# Altium project FlameClock_1.1.PrjPcb
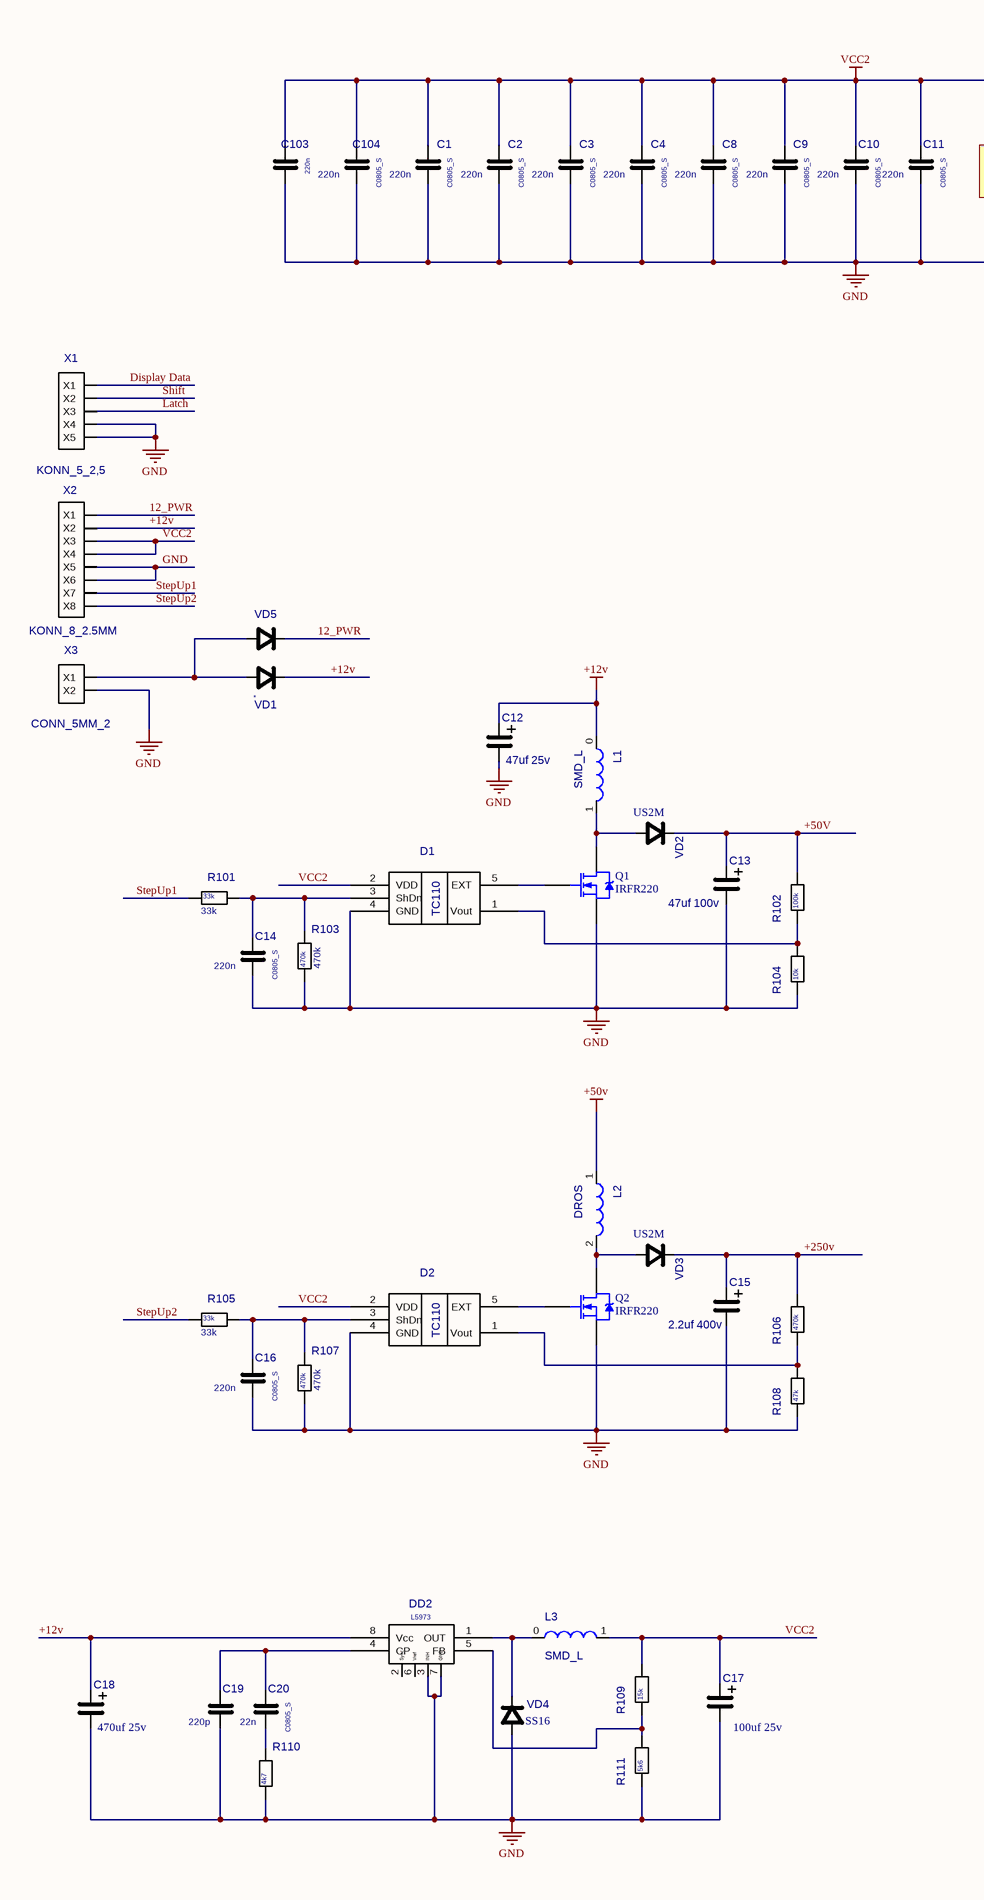
[diagram p0: FlameClock_1.1.SchDoc, left]
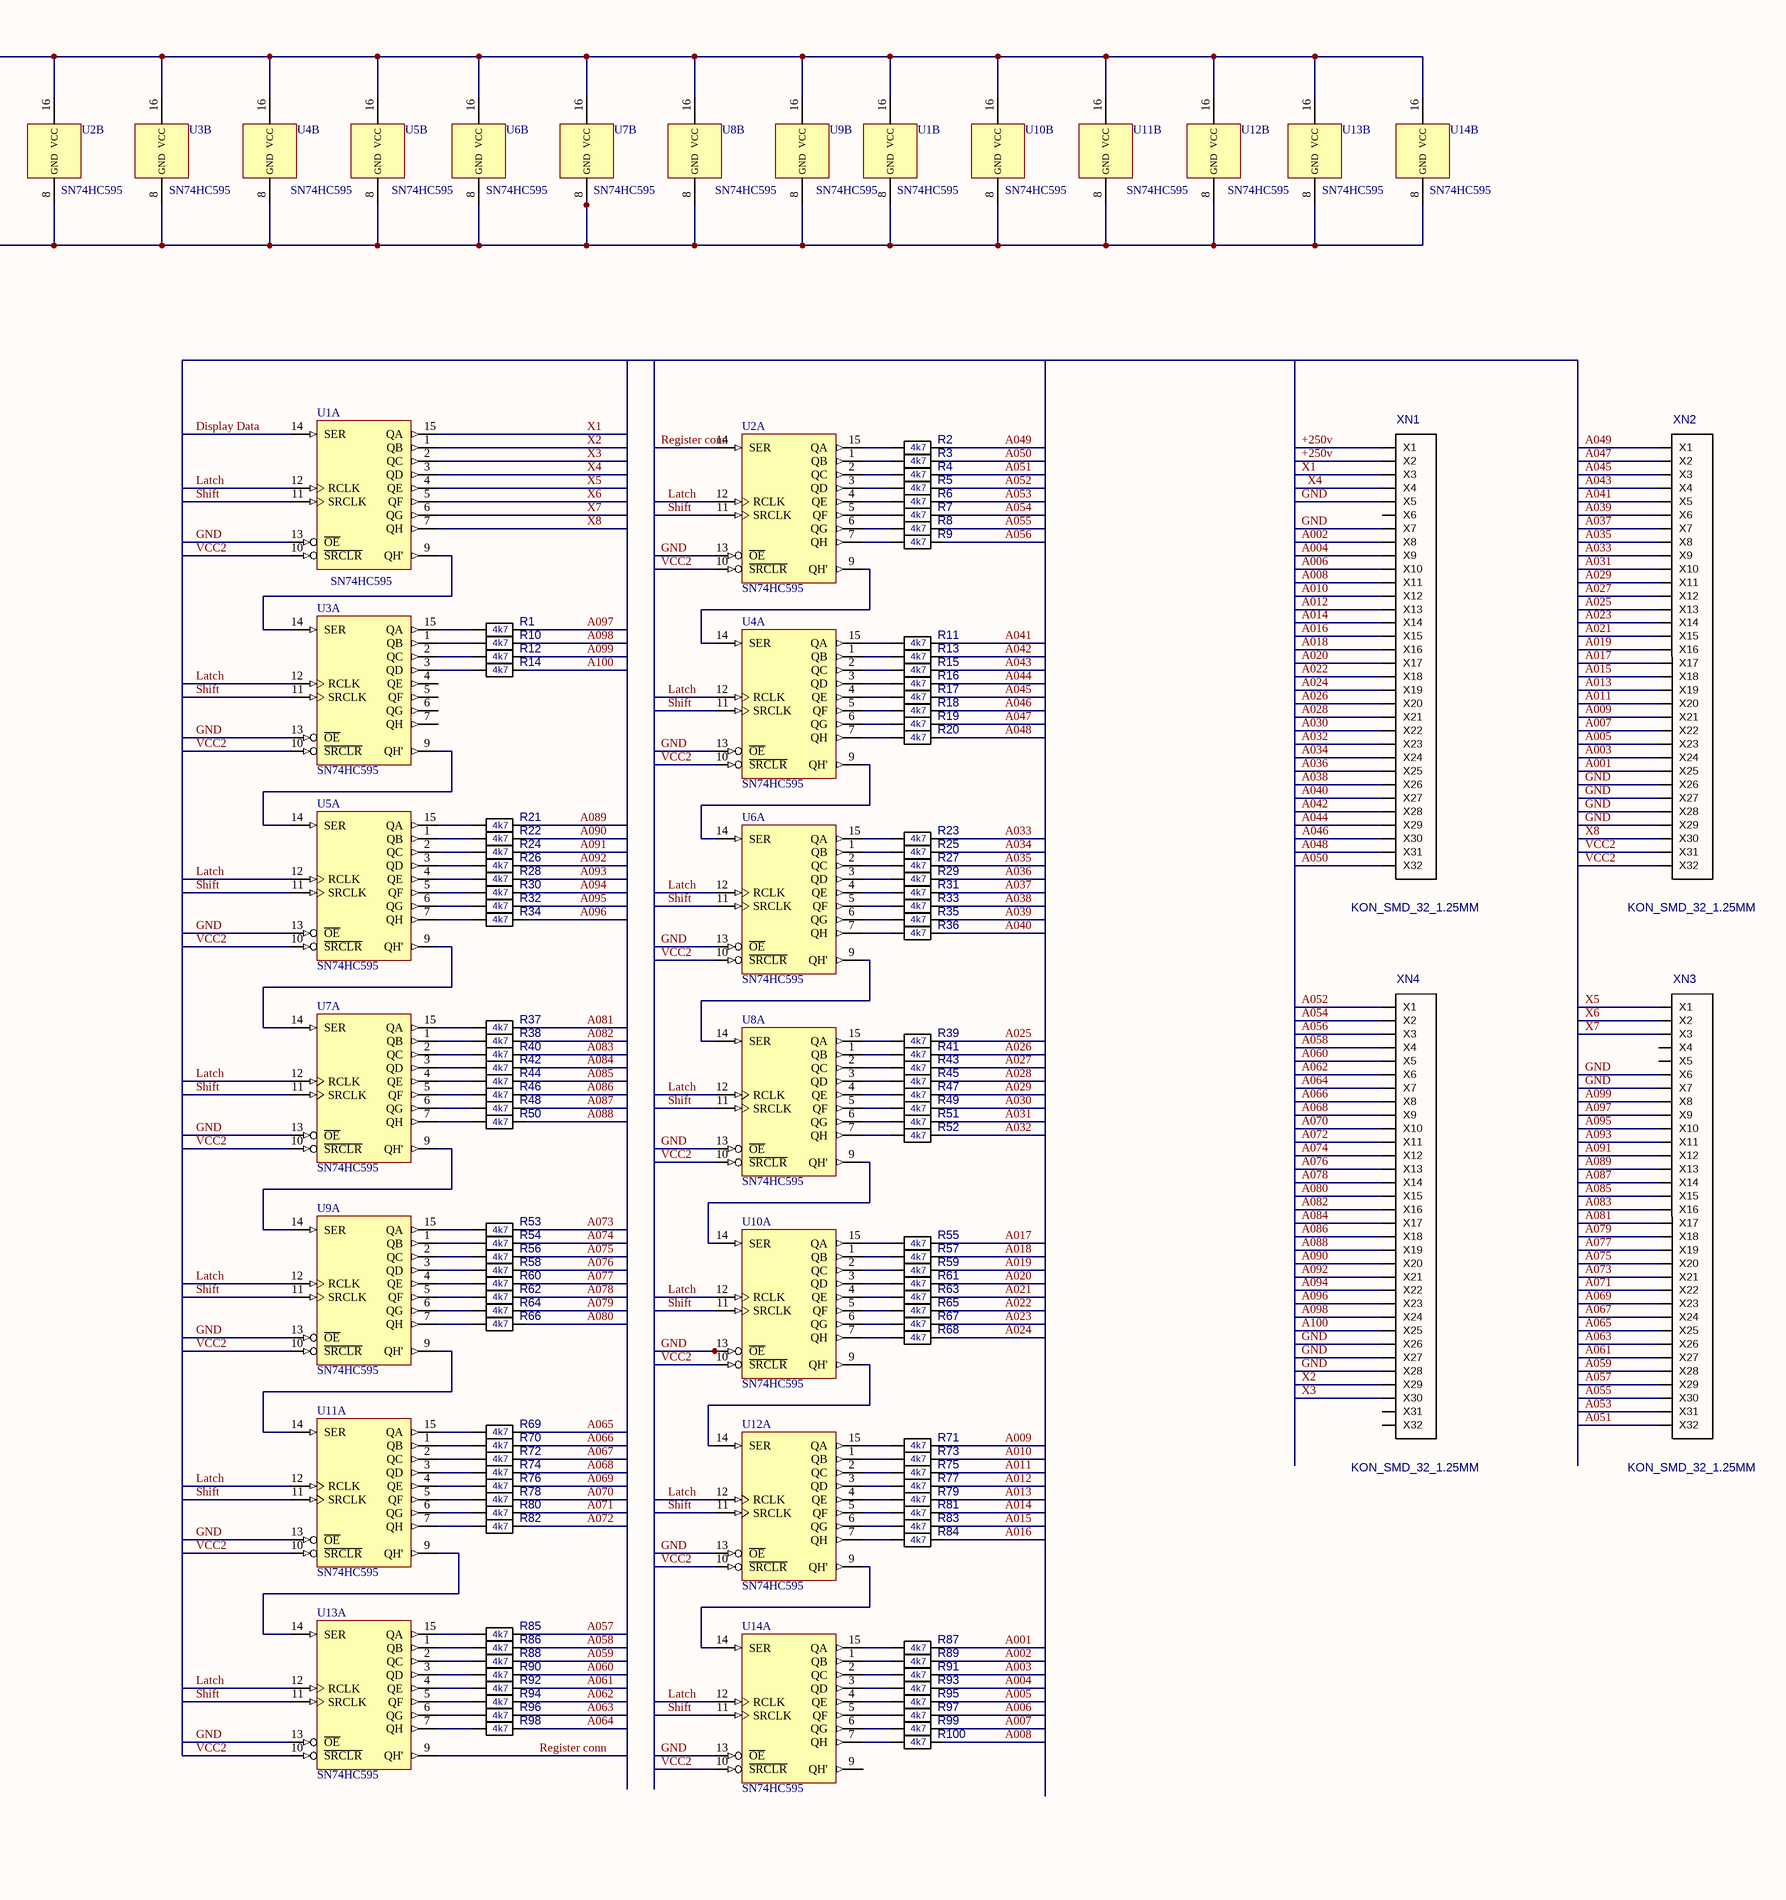
[diagram p1: FlameClock_1.1.SchDoc, right]
2 sheets, 205 parts. Net scope: global (net labels, ports and power ports of the same name join across sheets).
Board files: FlameClock_1.1.PcbDoc, FlameClock_1.1_sh2.PcbDoc
Sheets:
  FlameClock_1.1.SchDoc
  FlameClock_1.1_sh2.SchDoc

## Sheet FlameClock_1.1.SchDoc
size A2

### Parts
C1  C0805_S  value 220n  [CC0805_S]
C2  C0805_S  value 220n  [CC0805_S]
C3  C0805_S  value 220n  [CC0805_S]
C4  C0805_S  value 220n  [CC0805_S]
C8  C0805_S  value 220n  [CC0805_S]
C9  C0805_S  value 220n  [CC0805_S]
C10  C0805_S  value 220n  [CC0805_S]
C11  C0805_S  value 220n  [CC0805_S]
C12  47uf 25v  [CE3.8]
C13  47uf 100v  [CE3.8]
C14  C0805_S  value 220n  [CC0805_S]
C15  2.2uf 400v  [CE3.8]
C16  C0805_S  value 220n  [CC0805_S]
C17  100uf 25v  [CE3.8]
C18  470uf 25v  [CE10]
C19  value 220p  [CC0805_S]  (hidden comment: C0805_S)
C20  C0805_S  value 22n  [CC0805_S]
C103  220n  [CC0805_S]
C104  C0805_S  value 220n  [CC0805_S]
D1  TC110  [SOT-23A]
D2  TC110  [SOT-23A]
DD2  L5973  [SO8 - termal]
L1  SMD_L  [SMD_L]
L2  DROS  [DROS]
L3  SMD_L  [SMD_L]
Q1  IRFR220  [TO-252AA_N]
Q2  IRFR220  [TO-252AA_N]
R1  value 4k7  [R0805_S]  (hidden comment: R0805_S)
R2  value 4k7  [R0805_S]  (hidden comment: R0805_S)
R3  value 4k7  [R0805_S]  (hidden comment: R0805_S)
R4  value 4k7  [R0805_S]  (hidden comment: R0805_S)
R5  value 4k7  [R0805_S]  (hidden comment: R0805_S)
R6  value 4k7  [R0805_S]  (hidden comment: R0805_S)
R7  value 4k7  [R0805_S]  (hidden comment: R0805_S)
R8  value 4k7  [R0805_S]  (hidden comment: R0805_S)
R9  value 4k7  [R0805_S]  (hidden comment: R0805_S)
R10  value 4k7  [R0805_S]  (hidden comment: R0805_S)
R11  value 4k7  [R0805_S]  (hidden comment: R0805_S)
R12  value 4k7  [R0805_S]  (hidden comment: R0805_S)
R13  value 4k7  [R0805_S]  (hidden comment: R0805_S)
R14  value 4k7  [R0805_S]  (hidden comment: R0805_S)
R15  value 4k7  [R0805_S]  (hidden comment: R0805_S)
R16  value 4k7  [R0805_S]  (hidden comment: R0805_S)
R17  value 4k7  [R0805_S]  (hidden comment: R0805_S)
R18  value 4k7  [R0805_S]  (hidden comment: R0805_S)
R19  value 4k7  [R0805_S]  (hidden comment: R0805_S)
R20  value 4k7  [R0805_S]  (hidden comment: R0805_S)
R21  value 4k7  [R0805_S]  (hidden comment: R0805_S)
R22  value 4k7  [R0805_S]  (hidden comment: R0805_S)
R23  value 4k7  [R0805_S]  (hidden comment: R0805_S)
R24  value 4k7  [R0805_S]  (hidden comment: R0805_S)
R25  value 4k7  [R0805_S]  (hidden comment: R0805_S)
R26  value 4k7  [R0805_S]  (hidden comment: R0805_S)
R27  value 4k7  [R0805_S]  (hidden comment: R0805_S)
R28  value 4k7  [R0805_S]  (hidden comment: R0805_S)
R29  value 4k7  [R0805_S]  (hidden comment: R0805_S)
R30  value 4k7  [R0805_S]  (hidden comment: R0805_S)
R31  value 4k7  [R0805_S]  (hidden comment: R0805_S)
R32  value 4k7  [R0805_S]  (hidden comment: R0805_S)
R33  value 4k7  [R0805_S]  (hidden comment: R0805_S)
R34  value 4k7  [R0805_S]  (hidden comment: R0805_S)
R35  value 4k7  [R0805_S]  (hidden comment: R0805_S)
R36  value 4k7  [R0805_S]  (hidden comment: R0805_S)
R37  value 4k7  [R0805_S]  (hidden comment: R0805_S)
R38  value 4k7  [R0805_S]  (hidden comment: R0805_S)
R39  value 4k7  [R0805_S]  (hidden comment: R0805_S)
R40  value 4k7  [R0805_S]  (hidden comment: R0805_S)
R41  value 4k7  [R0805_S]  (hidden comment: R0805_S)
R42  value 4k7  [R0805_S]  (hidden comment: R0805_S)
R43  value 4k7  [R0805_S]  (hidden comment: R0805_S)
R44  value 4k7  [R0805_S]  (hidden comment: R0805_S)
R45  value 4k7  [R0805_S]  (hidden comment: R0805_S)
R46  value 4k7  [R0805_S]  (hidden comment: R0805_S)
R47  value 4k7  [R0805_S]  (hidden comment: R0805_S)
R48  value 4k7  [R0805_S]  (hidden comment: R0805_S)
R49  value 4k7  [R0805_S]  (hidden comment: R0805_S)
R50  value 4k7  [R0805_S]  (hidden comment: R0805_S)
R51  value 4k7  [R0805_S]  (hidden comment: R0805_S)
R52  value 4k7  [R0805_S]  (hidden comment: R0805_S)
R53  value 4k7  [R0805_S]  (hidden comment: R0805_S)
R54  value 4k7  [R0805_S]  (hidden comment: R0805_S)
R55  value 4k7  [R0805_S]  (hidden comment: R0805_S)
R56  value 4k7  [R0805_S]  (hidden comment: R0805_S)
R57  value 4k7  [R0805_S]  (hidden comment: R0805_S)
R58  value 4k7  [R0805_S]  (hidden comment: R0805_S)
R59  value 4k7  [R0805_S]  (hidden comment: R0805_S)
R60  value 4k7  [R0805_S]  (hidden comment: R0805_S)
R61  value 4k7  [R0805_S]  (hidden comment: R0805_S)
R62  value 4k7  [R0805_S]  (hidden comment: R0805_S)
R63  value 4k7  [R0805_S]  (hidden comment: R0805_S)
R64  value 4k7  [R0805_S]  (hidden comment: R0805_S)
R65  value 4k7  [R0805_S]  (hidden comment: R0805_S)
R66  value 4k7  [R0805_S]  (hidden comment: R0805_S)
R67  value 4k7  [R0805_S]  (hidden comment: R0805_S)
R68  value 4k7  [R0805_S]  (hidden comment: R0805_S)
R69  value 4k7  [R0805_S]  (hidden comment: R0805_S)
R70  value 4k7  [R0805_S]  (hidden comment: R0805_S)
R71  value 4k7  [R0805_S]  (hidden comment: R0805_S)
R72  value 4k7  [R0805_S]  (hidden comment: R0805_S)
R73  value 4k7  [R0805_S]  (hidden comment: R0805_S)
R74  value 4k7  [R0805_S]  (hidden comment: R0805_S)
R75  value 4k7  [R0805_S]  (hidden comment: R0805_S)
R76  value 4k7  [R0805_S]  (hidden comment: R0805_S)
R77  value 4k7  [R0805_S]  (hidden comment: R0805_S)
R78  value 4k7  [R0805_S]  (hidden comment: R0805_S)
R79  value 4k7  [R0805_S]  (hidden comment: R0805_S)
R80  value 4k7  [R0805_S]  (hidden comment: R0805_S)
R81  value 4k7  [R0805_S]  (hidden comment: R0805_S)
R82  value 4k7  [R0805_S]  (hidden comment: R0805_S)
R83  value 4k7  [R0805_S]  (hidden comment: R0805_S)
R84  value 4k7  [R0805_S]  (hidden comment: R0805_S)
R85  value 4k7  [R0805_S]  (hidden comment: R0805_S)
R86  value 4k7  [R0805_S]  (hidden comment: R0805_S)
R87  value 4k7  [R0805_S]  (hidden comment: R0805_S)
R88  value 4k7  [R0805_S]  (hidden comment: R0805_S)
R89  value 4k7  [R0805_S]  (hidden comment: R0805_S)
R90  value 4k7  [R0805_S]  (hidden comment: R0805_S)
R91  value 4k7  [R0805_S]  (hidden comment: R0805_S)
R92  value 4k7  [R0805_S]  (hidden comment: R0805_S)
R93  value 4k7  [R0805_S]  (hidden comment: R0805_S)
R94  value 4k7  [R0805_S]  (hidden comment: R0805_S)
R95  value 4k7  [R0805_S]  (hidden comment: R0805_S)
R96  value 4k7  [R0805_S]  (hidden comment: R0805_S)
R97  value 4k7  [R0805_S]  (hidden comment: R0805_S)
R98  value 4k7  [R0805_S]  (hidden comment: R0805_S)
R99  value 4k7  [R0805_S]  (hidden comment: R0805_S)
R100  value 4k7  [R0805_S]  (hidden comment: R0805_S)
R101  33k  [R0805_S]
R102  100k  [R0805_S]
R103  470k  [R0805_S]
R104  10k  [R0805_S]
R105  33k  [R0805_S]
R106  470k  [R0805_S]
R107  470k  [R0805_S]
R108  47k  [R0805_S]
R109  15k  [R0805_S]
R110  4k7  [R0805_S]
R111  5k6  [R0805_S]
U1  SN74HC595  [SOIC16]  (parts A,B of 2)
U2  SN74HC595  [SOIC16]  (parts A,B of 2)
U3  SN74HC595  [SOIC16]  (parts A,B of 2)
U4  SN74HC595  [SOIC16]  (parts A,B of 2)
U5  SN74HC595  [SOIC16]  (parts A,B of 2)
U6  SN74HC595  [SOIC16]  (parts A,B of 2)
U7  SN74HC595  [SOIC16]  (parts A,B of 2)
U8  SN74HC595  [SOIC16]  (parts A,B of 2)
U9  SN74HC595  [SOIC16]  (parts A,B of 2)
U10  SN74HC595  [SOIC16]  (parts A,B of 2)
U11  SN74HC595  [SOIC16]  (parts A,B of 2)
U12  SN74HC595  [SOIC16]  (parts A,B of 2)
U13  SN74HC595  [SOIC16]  (parts A,B of 2)
U14  SN74HC595  [SOIC16]  (parts A,B of 2)
VD1  *  [DIOD_SS2]
VD2  value US2M  [DIOD_SS1]  (hidden comment: DIODE_SS1)
VD3  value US2M  [DIOD_SS1]  (hidden comment: DIODE_SS1)
VD4  value SS16  [DIOD_SS1]  (hidden comment: DIODE_SS1)
VD5  DIODE_SS1  [DIOD_SS1]  (value not drawn)
X1  KONN_5_2,5  [KONN_5_2.5MM]
X2  KONN_8_2.5MM  [KONN_8_2.5MM]
X3  CONN_5MM_2  [CONN5_2]
XN1  KON_SMD_32_1.25MM  [KON_SMD_32_1.25MM]
XN2  KON_SMD_32_1.25MM  [KON_SMD_32_1.25MM]
XN3  KON_SMD_32_1.25MM  [KON_SMD_32_1.25MM]
XN4  KON_SMD_32_1.25MM  [KON_SMD_32_1.25MM]

### Nets
+12v: C12.1(pl) C18.1(pl) DD2.8(Vcc) L1.0 VD1.1 X2.2(X2)
+50V: C13.1(pl) L2.1 R102.1 VD2.1
GND: C1.2 C2.2 C3.2 C4.2 C8.2 C9.2 C10.2 C11.2 C12.2(min) C13.2(min) C14.2 C15.2(min) C16.2 C17.2(min) C18.2(min) C19.2 C103.2 C104.2 D1.4(GND) D2.4(GND) DD2.3(INH) DD2.7(GND) Q1.3(S) Q2.3(S) R103.2 R104.2 R107.2 R108.2 R110.2 R111.2 U1.8(GND) U1.13(~{OE}) U2.8(GND) U2.13(~{OE}) U3.8(GND) U3.13(~{OE}) U4.8(GND) U4.13(~{OE}) U5.8(GND) U5.13(~{OE}) U6.8(GND) U6.13(~{OE}) U7.8(GND) U7.13(~{OE}) U8.8(GND) U8.13(~{OE}) U9.8(GND) U9.13(~{OE}) U10.8(GND) U10.13(~{OE}) U11.8(GND) U11.13(~{OE}) U12.8(GND) U12.13(~{OE}) U13.8(GND) U13.13(~{OE}) U14.8(GND) U14.13(~{OE}) VD4.2 X1.4(X4) X1.5(X5) X2.5(X5) X2.6(X6) X3.2(X2) XN1.5(X5) XN1.7(X7) XN2.26(X26) XN2.27(X27) XN2.28(X28) XN2.29(X29) XN3.6(X6) XN3.7(X7) XN4.26(X26) XN4.27(X27) XN4.28(X28)
VCC2: C1.1 C2.1 C3.1 C4.1 C8.1 C9.1 C10.1 C11.1 C17.1(pl) C103.1 C104.1 D1.2(VDD) D2.2(VDD) L3.1 R109.1 U1.10(~{SRCLR}) U1.16(VCC) U2.10(~{SRCLR}) U2.16(VCC) U3.10(~{SRCLR}) U3.16(VCC) U4.10(~{SRCLR}) U4.16(VCC) U5.10(~{SRCLR}) U5.16(VCC) U6.10(~{SRCLR}) U6.16(VCC) U7.10(~{SRCLR}) U7.16(VCC) U8.10(~{SRCLR}) U8.16(VCC) U9.10(~{SRCLR}) U9.16(VCC) U10.10(~{SRCLR}) U10.16(VCC) U11.10(~{SRCLR}) U11.16(VCC) U12.10(~{SRCLR}) U12.16(VCC) U13.10(~{SRCLR}) U13.16(VCC) U14.10(~{SRCLR}) U14.16(VCC) X2.3(X3) X2.4(X4) XN2.31(X31) XN2.32(X32)
12_PWR: VD5.1 X2.1(X1)
+250v: C15.1(pl) R106.1 VD3.1 XN1.1(X1) XN1.2(X2)
A001: R87.1 XN2.25(X25)
A002: R89.1 XN1.8(X8)
A003: R91.1 XN2.24(X24)
A004: R93.1 XN1.9(X9)
A005: R95.1 XN2.23(X23)
A006: R97.1 XN1.10(X10)
A007: R99.1 XN2.22(X22)
A008: R100.1 XN1.11(X11)
A009: R71.1 XN2.21(X21)
A010: R73.1 XN1.12(X12)
A011: R75.1 XN2.20(X20)
A012: R77.1 XN1.13(X13)
A013: R79.1 XN2.19(X19)
A014: R81.1 XN1.14(X14)
A015: R83.1 XN2.18(X18)
A016: R84.1 XN1.15(X15)
A017: R55.1 XN2.17(X17)
A018: R57.1 XN1.16(X16)
A019: R59.1 XN2.16(X16)
A020: R61.1 XN1.17(X17)
A021: R63.1 XN2.15(X15)
A022: R65.1 XN1.18(X18)
A023: R67.1 XN2.14(X14)
A024: R68.1 XN1.19(X19)
A025: R39.1 XN2.13(X13)
A026: R41.1 XN1.20(X20)
A027: R43.1 XN2.12(X12)
A028: R45.1 XN1.21(X21)
A029: R47.1 XN2.11(X11)
A030: R49.1 XN1.22(X22)
A031: R51.1 XN2.10(X10)
A032: R52.1 XN1.23(X23)
A033: R23.1 XN2.9(X9)
A034: R25.1 XN1.24(X24)
A035: R27.1 XN2.8(X8)
A036: R29.1 XN1.25(X25)
A037: R31.1 XN2.7(X7)
A038: R33.1 XN1.26(X26)
A039: R35.1 XN2.6(X6)
A040: R36.1 XN1.27(X27)
A041: R11.1 XN2.5(X5)
A042: R13.1 XN1.28(X28)
A043: R15.1 XN2.4(X4)
A044: R16.1 XN1.29(X29)
A045: R17.1 XN2.3(X3)
A046: R18.1 XN1.30(X30)
A047: R19.1 XN2.2(X2)
A048: R20.1 XN1.31(X31)
A049: R2.1 XN2.1(X1)
A050: R3.1 XN1.32(X32)
A051: R4.1 XN3.32(X32)
A052: R5.1 XN4.1(X1)
A053: R6.1 XN3.31(X31)
A054: R7.1 XN4.2(X2)
A055: R8.1 XN3.30(X30)
A056: R9.1 XN4.3(X3)
A057: R85.1 XN3.29(X29)
A058: R86.1 XN4.4(X4)
A059: R88.1 XN3.28(X28)
A060: R90.1 XN4.5(X5)
A061: R92.1 XN3.27(X27)
A062: R94.1 XN4.6(X6)
A063: R96.1 XN3.26(X26)
A064: R98.1 XN4.7(X7)
A065: R69.1 XN3.25(X25)
A066: R70.1 XN4.8(X8)
A067: R72.1 XN3.24(X24)
A068: R74.1 XN4.9(X9)
A069: R76.1 XN3.23(X23)
A070: R78.1 XN4.10(X10)
A071: R80.1 XN3.22(X22)
A072: R82.1 XN4.11(X11)
A073: R53.1 XN3.21(X21)
A074: R54.1 XN4.12(X12)
A075: R56.1 XN3.20(X20)
A076: R58.1 XN4.13(X13)
A077: R60.1 XN3.19(X19)
A078: R62.1 XN4.14(X14)
A079: R64.1 XN3.18(X18)
A080: R66.1 XN4.15(X15)
A081: R37.1 XN3.17(X17)
A082: R38.1 XN4.16(X16)
A083: R40.1 XN3.16(X16)
A084: R42.1 XN4.17(X17)
A085: R44.1 XN3.15(X15)
A086: R46.1 XN4.18(X18)
A087: R48.1 XN3.14(X14)
A088: R50.1 XN4.19(X19)
A089: R21.1 XN3.13(X13)
A090: R22.1 XN4.20(X20)
A091: R24.1 XN3.12(X12)
A092: R26.1 XN4.21(X21)
A093: R28.1 XN3.11(X11)
A094: R30.1 XN4.22(X22)
A095: R32.1 XN3.10(X10)
A096: R34.1 XN4.23(X23)
A097: R1.1 XN3.9(X9)
A098: R10.1 XN4.24(X24)
A099: R12.1 XN3.8(X8)
A100: R14.1 XN4.25(X25)
Display Data: U1.14(SER) X1.1(X1)
Latch: U1.12(RCLK) U2.12(RCLK) U3.12(RCLK) U4.12(RCLK) U5.12(RCLK) U6.12(RCLK) U7.12(RCLK) U8.12(RCLK) U9.12(RCLK) U10.12(RCLK) U11.12(RCLK) U12.12(RCLK) U13.12(RCLK) U14.12(RCLK) X1.3(X3)
Register conn: U2.14(SER) U13.9(QH')
Shift: U1.11(SRCLK) U2.11(SRCLK) U3.11(SRCLK) U4.11(SRCLK) U5.11(SRCLK) U6.11(SRCLK) U7.11(SRCLK) U8.11(SRCLK) U9.11(SRCLK) U10.11(SRCLK) U11.11(SRCLK) U12.11(SRCLK) U13.11(SRCLK) U14.11(SRCLK) X1.2(X2)
StepUp1: R101.2 X2.7(X7)
StepUp2: R105.2 X2.8(X8)
X1: U1.15(QA) XN1.3(X3)
X2: U1.1(QB) XN4.29(X29)
X3: U1.2(QC) XN4.30(X30)
X4: U1.3(QD) XN1.4(X4)
X5: U1.4(QE) XN3.1(X1)
X6: U1.5(QF) XN3.2(X2)
X7: U1.6(QG) XN3.3(X3)
X8: U1.7(QH) XN2.30(X30)
NetC14_1: C14.1 D1.3(ShDn) R101.1 R103.1
NetC16_1: C16.1 D2.3(ShDn) R105.1 R107.1
NetC19_1: C19.1 C20.1 DD2.4(CP)
NetC20_2: C20.2 R110.1
NetD1_1: D1.1(Vout) R102.2 R104.1
NetD1_5: D1.5(EXT) Q1.1(G)
NetD2_1: D2.1(Vout) R106.2 R108.1
NetD2_5: D2.5(EXT) Q2.1(G)
NetDD2_1: DD2.1(OUT) L3.0 VD4.1
NetDD2_5: DD2.5(FB) R109.2 R111.1
NetL1_1: L1.1 Q1.4(D) VD2.2
NetL2_2: L2.2 Q2.4(D) VD3.2
NetR1_2: R1.2 U3.15(QA)
NetR2_2: R2.2 U2.15(QA)
NetR3_2: R3.2 U2.1(QB)
NetR4_2: R4.2 U2.2(QC)
NetR5_2: R5.2 U2.3(QD)
NetR6_2: R6.2 U2.4(QE)
NetR7_2: R7.2 U2.5(QF)
NetR8_2: R8.2 U2.6(QG)
NetR9_2: R9.2 U2.7(QH)
NetR10_2: R10.2 U3.1(QB)
NetR11_2: R11.2 U4.15(QA)
NetR12_2: R12.2 U3.2(QC)
NetR13_2: R13.2 U4.1(QB)
NetR14_2: R14.2 U3.3(QD)
NetR15_2: R15.2 U4.2(QC)
NetR16_2: R16.2 U4.3(QD)
NetR17_2: R17.2 U4.4(QE)
NetR18_2: R18.2 U4.5(QF)
NetR19_2: R19.2 U4.6(QG)
NetR20_2: R20.2 U4.7(QH)
NetR21_2: R21.2 U5.15(QA)
NetR22_2: R22.2 U5.1(QB)
NetR23_2: R23.2 U6.15(QA)
NetR24_2: R24.2 U5.2(QC)
NetR25_2: R25.2 U6.1(QB)
NetR26_2: R26.2 U5.3(QD)
NetR27_2: R27.2 U6.2(QC)
NetR28_2: R28.2 U5.4(QE)
NetR29_2: R29.2 U6.3(QD)
NetR30_2: R30.2 U5.5(QF)
NetR31_2: R31.2 U6.4(QE)
NetR32_2: R32.2 U5.6(QG)
NetR33_2: R33.2 U6.5(QF)
NetR34_2: R34.2 U5.7(QH)
NetR35_2: R35.2 U6.6(QG)
NetR36_2: R36.2 U6.7(QH)
NetR37_2: R37.2 U7.15(QA)
NetR38_2: R38.2 U7.1(QB)
NetR39_2: R39.2 U8.15(QA)
NetR40_2: R40.2 U7.2(QC)
NetR41_2: R41.2 U8.1(QB)
NetR42_2: R42.2 U7.3(QD)
NetR43_2: R43.2 U8.2(QC)
NetR44_2: R44.2 U7.4(QE)
NetR45_2: R45.2 U8.3(QD)
NetR46_2: R46.2 U7.5(QF)
NetR47_2: R47.2 U8.4(QE)
NetR48_2: R48.2 U7.6(QG)
NetR49_2: R49.2 U8.5(QF)
NetR50_2: R50.2 U7.7(QH)
NetR51_2: R51.2 U8.6(QG)
NetR52_2: R52.2 U8.7(QH)
NetR53_2: R53.2 U9.15(QA)
NetR54_2: R54.2 U9.1(QB)
NetR55_2: R55.2 U10.15(QA)
NetR56_2: R56.2 U9.2(QC)
NetR57_2: R57.2 U10.1(QB)
NetR58_2: R58.2 U9.3(QD)
NetR59_2: R59.2 U10.2(QC)
NetR60_2: R60.2 U9.4(QE)
NetR61_2: R61.2 U10.3(QD)
NetR62_2: R62.2 U9.5(QF)
NetR63_2: R63.2 U10.4(QE)
NetR64_2: R64.2 U9.6(QG)
NetR65_2: R65.2 U10.5(QF)
NetR66_2: R66.2 U9.7(QH)
NetR67_2: R67.2 U10.6(QG)
NetR68_2: R68.2 U10.7(QH)
NetR69_2: R69.2 U11.15(QA)
NetR70_2: R70.2 U11.1(QB)
NetR71_2: R71.2 U12.15(QA)
NetR72_2: R72.2 U11.2(QC)
NetR73_2: R73.2 U12.1(QB)
NetR74_2: R74.2 U11.3(QD)
NetR75_2: R75.2 U12.2(QC)
NetR76_2: R76.2 U11.4(QE)
NetR77_2: R77.2 U12.3(QD)
NetR78_2: R78.2 U11.5(QF)
NetR79_2: R79.2 U12.4(QE)
NetR80_2: R80.2 U11.6(QG)
NetR81_2: R81.2 U12.5(QF)
NetR82_2: R82.2 U11.7(QH)
NetR83_2: R83.2 U12.6(QG)
NetR84_2: R84.2 U12.7(QH)
NetR85_2: R85.2 U13.15(QA)
NetR86_2: R86.2 U13.1(QB)
NetR87_2: R87.2 U14.15(QA)
NetR88_2: R88.2 U13.2(QC)
NetR89_2: R89.2 U14.1(QB)
NetR90_2: R90.2 U13.3(QD)
NetR91_2: R91.2 U14.2(QC)
NetR92_2: R92.2 U13.4(QE)
NetR93_2: R93.2 U14.3(QD)
NetR94_2: R94.2 U13.5(QF)
NetR95_2: R95.2 U14.4(QE)
NetR96_2: R96.2 U13.6(QG)
NetR97_2: R97.2 U14.5(QF)
NetR98_2: R98.2 U13.7(QH)
NetR99_2: R99.2 U14.6(QG)
NetR100_2: R100.2 U14.7(QH)
NetU1_9: U1.9(QH') U3.14(SER)
NetU2_9: U2.9(QH') U4.14(SER)
NetU3_9: U3.9(QH') U5.14(SER)
NetU4_9: U4.9(QH') U6.14(SER)
NetU5_9: U5.9(QH') U7.14(SER)
NetU6_9: U6.9(QH') U8.14(SER)
NetU7_9: U7.9(QH') U9.14(SER)
NetU8_9: U8.9(QH') U10.14(SER)
NetU9_9: U9.9(QH') U11.14(SER)
NetU10_9: U10.9(QH') U12.14(SER)
NetU11_9: U11.9(QH') U13.14(SER)
NetU12_9: U12.9(QH') U14.14(SER)
NetVD1_2: VD1.2 VD5.2 X3.1(X1)

Not connected (* = marked no-connect by the designer): DD2 2(Sync) 6(Vref); U3 4(QE) 5(QF) 6(QG) 7(QH); U14 9(QH'); XN1 6(X6); XN3 4(X4) 5(X5); XN4 31(X31) 32(X32)

### Library data of the parts
C12 C13 C15 C17 = CE3.8_6.5MM
  C12: Value: 47uf 25v
  C13: Value: 47uf 100v
  C15: Value: 2.2uf 400v
  C17: Value: 100uf 25v
C18 = CE5.0_10MM: Value: 470uf 25v
C103 = C0805_S: Value: 220n
L1 L3 = SMD_L: Value: 100mH
L2 = DROS: Value: 100mH
Q1 Q2 = IRFR220: HEXFET Power MOSFET; Note: Pin 2 is trimmed and is electrically connected to Drain.; Published: 8-Jun-2000; LatestRevisionDate: 20-Nov-2009; LatestRevisionNote: IPC-7351 Footprint Added.; DatasheetVersion: PD-9.525D; PackageVersion: Feb-2003; PackageReference: TO-252AA; Publisher: Altium Limited; PackageDescription: 3-Pin HEXFET Package 2.28 mm Pitch, 9.9 mm Lead Span; Code_JEDEC: TO-252-AA; ComponentLink1Description: Manufacturer Link; ComponentLink1URL: http://www.irf.com/; ComponentLink2Description: Datasheet; ComponentLink2URL: http://www.irf.com/product-info/datasheets/data/irfr220.pdf
R101-R111 = R0805_S
  R101 R105: Value: 33k
  R102: Value: 100k
  R103 R106 R107: Value: 470k
  R104: Value: 10k
  R108: Value: 47k
  R109: Value: 15k
  R110: Value: 4k7
  R111: Value: 5k6
U1-U14 = SN74HC595: 8-Bit Shift Registers with 3-State Output Registers
VD1 = DIODE_SS2: Value: *
D1 D2 = TC110: Value: *
DD2 = L5973: Value: *
VD2-VD5 = DIODE_SS1
  VD5: Value: *
X1 = KONN_5_2,5: Value: *
X2 = KONN_8_2.5MM: Value: *
X3 = CONN_5MM_2: Value: *
XN1-XN4 = KON_SMD_32_1.25MM: Value: *

## Sheet FlameClock_1.1_sh2.SchDoc
size A3
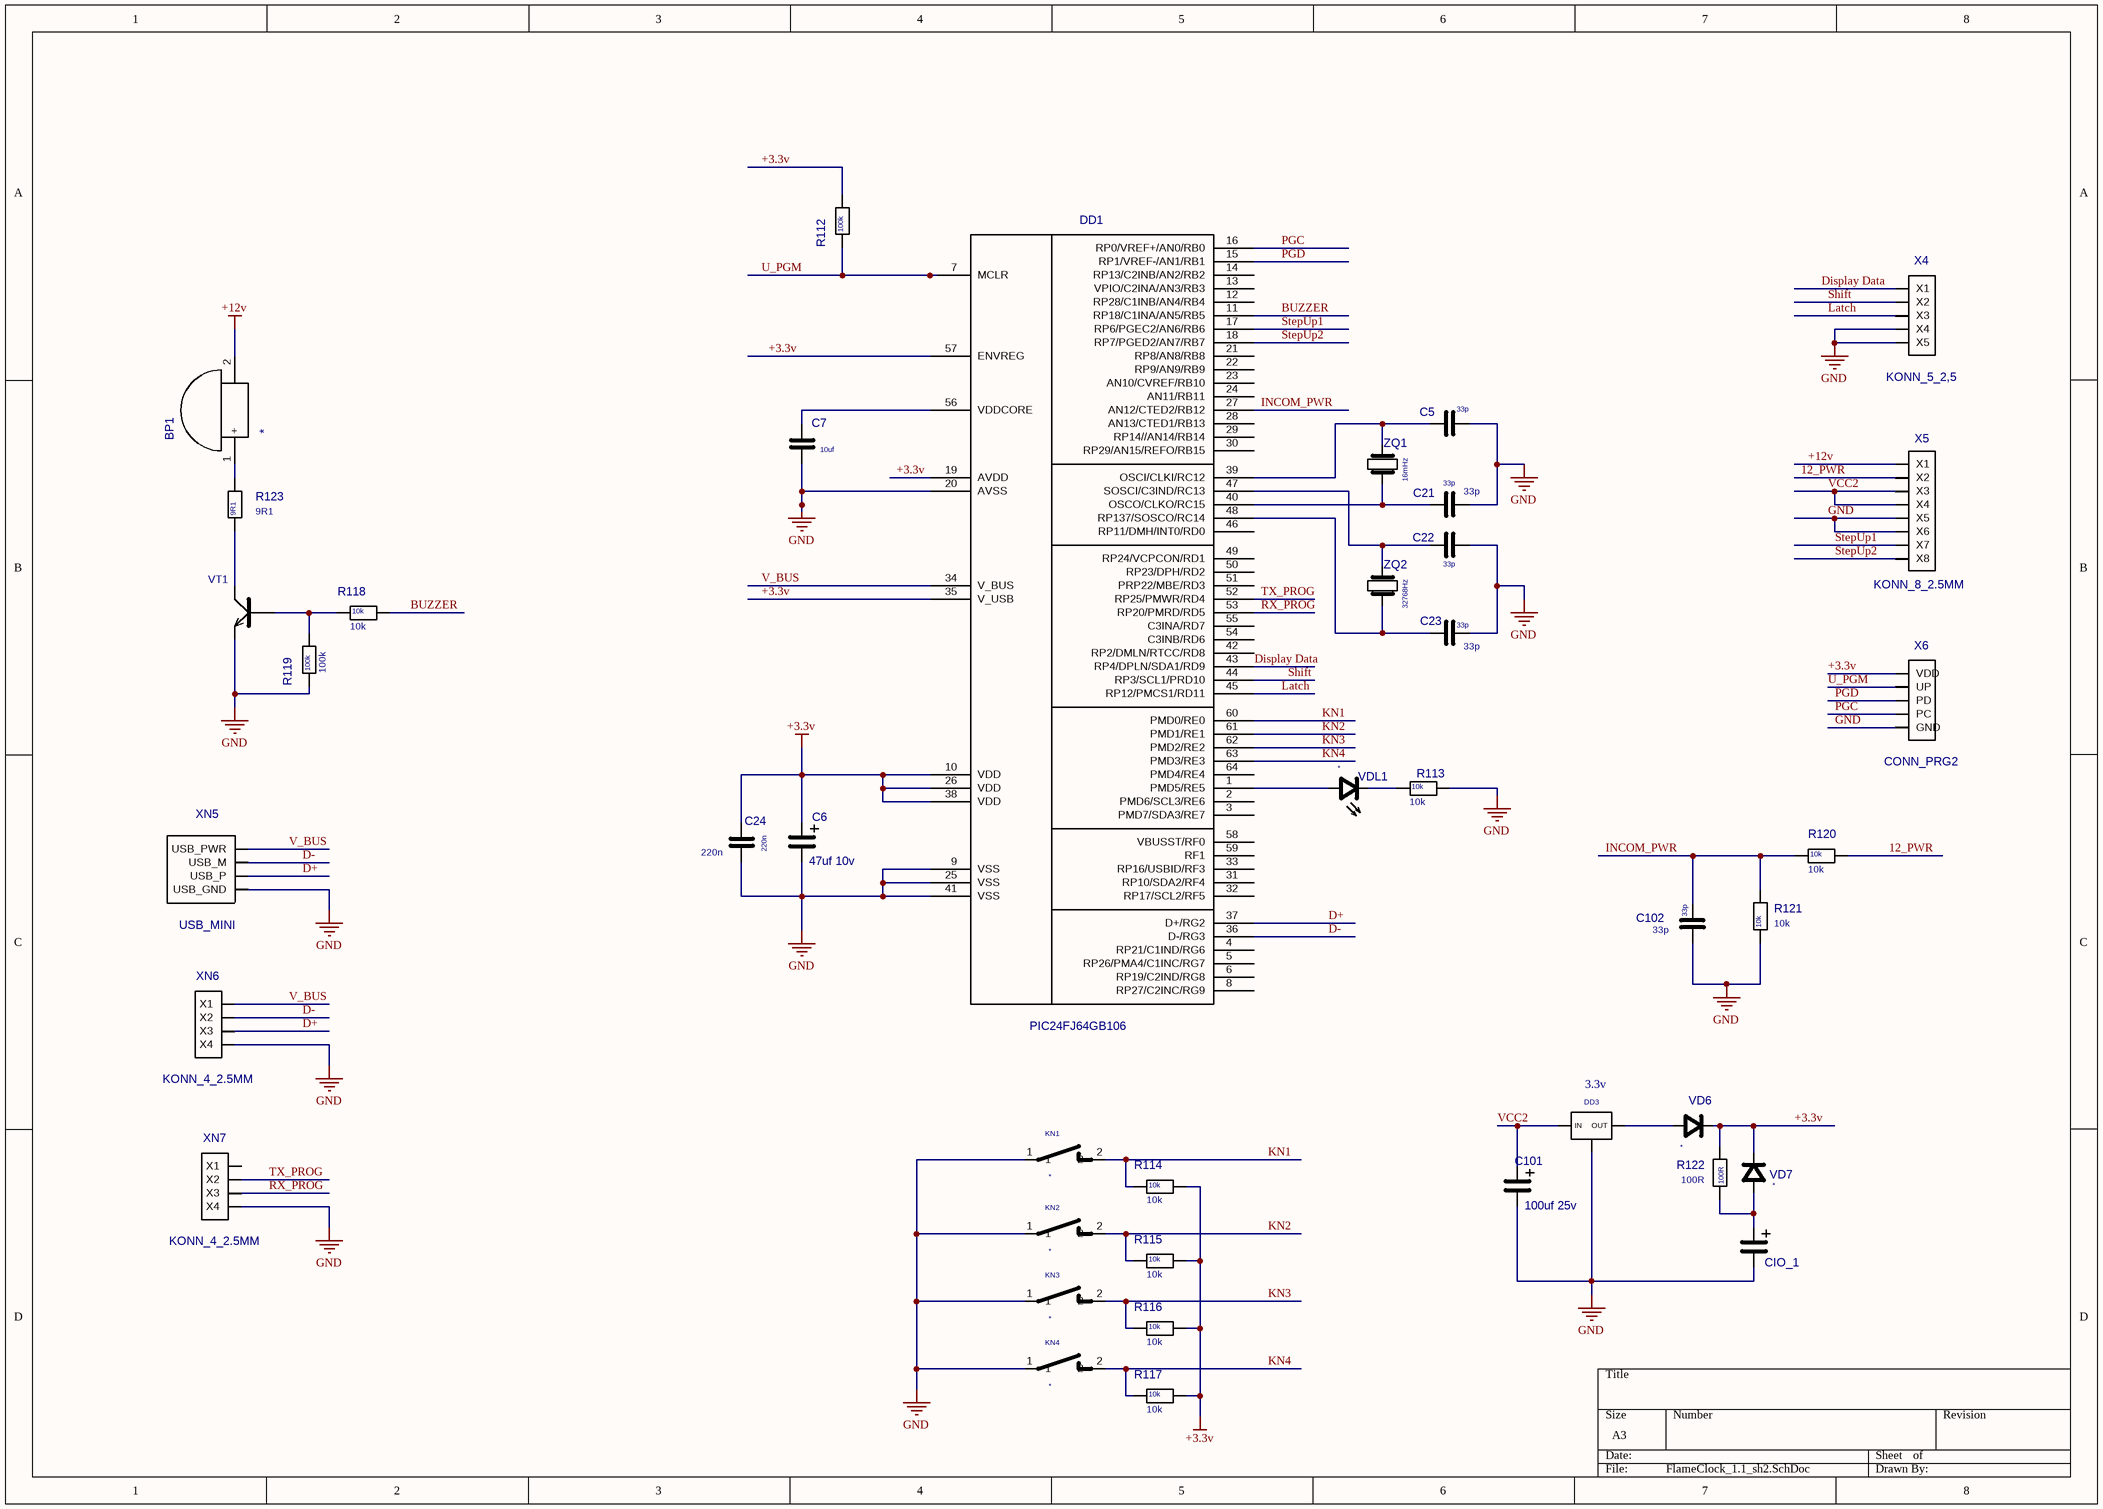
[diagram p2: FlameClock_1.1_sh2.SchDoc]

### Parts
BP1  *  [ZIPPER]
C5  33p  [CC0805_S]
C6  47uf 10v  [CC0805_C_TANTAL_POLAR]
C7  10uf  [CC0805_B]
C21  33p  [CC0805_S]
C22  33p  [CC0805_S]
C23  33p  [CC0805_S]
C24  220n  [CC0805_S]
C101  100uf 25v  [CE2.5]
C102  33p  [CC0805_S]
CIO_1  *  [CE10]  (value not drawn)
DD1  PIC24FJ64GB106  [TQFP-64]
DD3  value 3.3v  [SOT223]  (hidden comment: LD1117S)
KN1  *  [KNOP_12X12]
KN2  *  [KNOP_12X12]
KN3  *  [KNOP_12X12]
KN4  *  [KNOP_12X12]
R112  100k  [R0805_S]
R113  10k  [R0805_S]
R114  10k  [R0805_S]
R115  10k  [R0805_S]
R116  10k  [R0805_S]
R117  10k  [R0805_S]
R118  10k  [R0805_S]
R119  100k  [R0805_S]
R120  10k  [R0805_S]
R121  10k  [R0805_S]
R122  100R  [R0805_S]
R123  9R1  [R0805_S]
VD6  *  [DIOD_SOD123]
VD7  *  [DIOD_SOD123]
VDL1  *  [LED0805]
VT1  *  [SOT-23]  (value not drawn)
X4  KONN_5_2,5  [KONN_5_2.5MM]
X5  KONN_8_2.5MM  [KONN_8_2.5MM]
X6  CONN_PRG2  [CONN_PRG2]
XN5  USB_MINI  [USB_MINI]
XN6  KONN_4_2.5MM  [KONN_4_2.5MM]
XN7  KONN_4_2.5MM  [KONN_4_2.5MM]
ZQ1  16mHz  [ZQ]
ZQ2  32768Hz  [ZQ_CLOCK]

### Nets
+3.3v: C6.2(pl) C24.1 DD1.10(VDD) DD1.19(AVDD) DD1.26(VDD) DD1.35(V_USB) DD1.38(VDD) DD1.57(ENVREG) R112.1 R114.1 R115.1 R116.1 R117.1 R122.1 VD6.1(k) VD7.1(k) X6.1(VDD)
+12v: BP1.2(-) X5.1(X1)
GND: C5.2 C6.1(min) C7.2 C21.2 C22.2 C23.2 C24.2 C101.2 C102.1 CIO_1.2(min) DD1.9(VSS) DD1.20(AVSS) DD1.25(VSS) DD1.41(VSS) DD3.3(GND) KN1.1 KN2.1 KN3.1 KN4.1 R113.1 R119.2 R121.2 VT1.3(e) X4.4(X4) X4.5(X5) X5.5(X5) X5.6(X6) X6.5(GND) XN5.5(USB_GND) XN6.4(X4) XN7.4(X4)
VCC2: C101.1 DD3.1(IN) X5.3(X3) X5.4(X4)
12_PWR: R120.1 X5.2(X2)
BUZZER: DD1.11(RP18/C1INA/AN5/RB5) R118.1
D+: DD1.37(D+/RG2) XN5.3(USB_P) XN6.3(X3)
D-: DD1.36(D-/RG3) XN5.2(USB_M) XN6.2(X2)
Display Data: DD1.43(RP4/DPLN/SDA1/RD9) X4.1(X1)
INCOM_PWR: C102.2 DD1.27(AN12/CTED2/RB12) R120.2 R121.1
KN1: DD1.60(PMD0/RE0) KN1.2 R114.2
KN2: DD1.61(PMD1/RE1) KN2.2 R115.2
KN3: DD1.62(PMD2/RE2) KN3.2 R116.2
KN4: DD1.63(PMD3/RE3) KN4.2 R117.2
Latch: DD1.45(RP12/PMCS1/RD11) X4.3(X3)
PGC: DD1.16(RP0/VREF+/AN0/RB0) X6.4(PC)
PGD: DD1.15(RP1/VREF-/AN1/RB1) X6.3(PD)
RX_PROG: DD1.53(RP20/PMRD/RD5) XN7.3(X3)
Shift: DD1.44(RP3/SCL1/PRD10) X4.2(X2)
StepUp1: DD1.17(RP6/PGEC2/AN6/RB6) X5.7(X7)
StepUp2: DD1.18(RP7/PGED2/AN7/RB7) X5.8(X8)
TX_PROG: DD1.52(RP25/PMWR/RD4) XN7.2(X2)
U_PGM: DD1.7(MCLR) R112.2 X6.2(UP)
V_BUS: DD1.34(V_BUS) XN5.1(USB_PWR) XN6.1(X1)
NetBP1_1: BP1.1(+) R123.1
NetC5_1: C5.1 DD1.39(OSCI/CLKI/RC12) ZQ1.1
NetC7_1: C7.1 DD1.56(VDDCORE)
NetC21_1: C21.1 DD1.40(OSCO/CLKO/RC15) ZQ1.2
NetC22_1: C22.1 DD1.47(SOSCI/C3IND/RC13) ZQ2.1
NetC23_1: C23.1 DD1.48(RP137/SOSCO/RC14) ZQ2.2
NetCIO_1_1: CIO_1.1(pl) R122.2 VD7.2(a)
NetDD1_1: DD1.1(PMD5/RE5) VDL1.2
NetDD3_2: DD3.2(OUT) VD6.2(a)
NetR113_2: R113.2 VDL1.1
NetR118_2: R118.2 R119.1 VT1.1(b)
NetR123_2: R123.2 VT1.2(k)

Not connected (* = marked no-connect by the designer): DD1 2(PMD6/SCL3/RE6) 3(PMD7/SDA3/RE7) 4(RP21/C1IND/RG6) 5(RP26/PMA4/C1INC/RG7) 6(RP19/C2IND/RG8) 8(RP27/C2INC/RG9) 12(RP28/C1INB/AN4/RB4) 13(VPIO/C2INA/AN3/RB3) 14(RP13/C2INB/AN2/RB2) 21(RP8/AN8/RB8) 22(RP9/AN9/RB9) 23(AN10/CVREF/RB10) 24(AN11/RB11) 28(AN13/CTED1/RB13) 29(RP14//AN14/RB14) 30(RP29/AN15/REFO/RB15) 31(RP10/SDA2/RF4) 32(RP17/SCL2/RF5) 33(RP16/USBID/RF3) 42(RP2/DMLN/RTCC/RD8) 46(RP11/DMH/INT0/RD0) 49(RP24/VCPCON/RD1) 50(RP23/DPH/RD2) 51(PRP22/MBE/RD3) 54(C3INB/RD6) 55(C3INA/RD7) 58(VBUSST/RF0) 59(RF1) 64(PMD4/RE4); DD3 4; KN1 3 4; KN2 3 4; KN3 3 4; KN4 3 4; XN5 4 6 7 8 9; XN7 1(X1); ZQ2 3

### Library data of the parts
BP1 = Buzzer: Value: *
C5 C21-C24 C102 = C0805_S
  C5 C21-C23 C102: Value: 33p
  C24: Value: 220n
C6 = C0805_C_TAN_POLAR: Value: 47uf 10v
C7 = C0805_B: Value: 10uf
C101 = CE2.5_5MM: Value: 100uf 25v
CIO_1 = CE5.0_10MM: Value: *
KN1-KN4 = KNOP_12X12: Value: *
R112-R123 = R0805_S
  R112 R119: Value: 100k
  R113-R118 R120 R121: Value: 10k
  R122: Value: 100R
  R123: Value: 9R1
VD6 VD7 = DIODE_SOD123: pin to pad: 1>2 2>1; Value: *
VDL1 = L_DIODE0805: Value: *
VT1 = NPN_SOT23: Value: *
ZQ1 = ZQ: Value: 16mHz
ZQ2 = ZQ_CLOCK: Value: 32768Hz
DD1 = PIC24FJ64GB106: Value: *
X4 = KONN_5_2,5: Value: *
X5 = KONN_8_2.5MM: Value: *
X6 = CONN_PRG2: Value: *
XN5 = USB_MINI: Value: *
XN6 XN7 = KONN_4_2.5MM: Value: *

## Nets that join several sheets
+12v: FlameClock_1.1 (6 pins), FlameClock_1.1_sh2 (BP1.2 X5.1)
GND: FlameClock_1.1 (75 pins), FlameClock_1.1_sh2 (31 pins)
VCC2: FlameClock_1.1 (47 pins), FlameClock_1.1_sh2 (C101.1 DD3.1 X5.3 X5.4)
12_PWR: FlameClock_1.1 (VD5.1 X2.1), FlameClock_1.1_sh2 (R120.1 X5.2)
Display Data: FlameClock_1.1 (U1.14 X1.1), FlameClock_1.1_sh2 (DD1.43 X4.1)
Latch: FlameClock_1.1 (15 pins), FlameClock_1.1_sh2 (DD1.45 X4.3)
Shift: FlameClock_1.1 (15 pins), FlameClock_1.1_sh2 (DD1.44 X4.2)
StepUp1: FlameClock_1.1 (R101.2 X2.7), FlameClock_1.1_sh2 (DD1.17 X5.7)
StepUp2: FlameClock_1.1 (R105.2 X2.8), FlameClock_1.1_sh2 (DD1.18 X5.8)